# Altium schematic sheet Mordovia_MCH_CLK.SchDoc: Mordovia_MCH_CLK
size 594 x 420 mm; PageSetup: Record=PageOptions|CenterHorizontal=True|CenterVertical=True|PrintScale=0.73|XCorrection==PcbVersion0|YCorrection==PcbVersion0|PrintKind=2|BorderSize=5000000|LeftOffset=0|BottomOffset=0|Orientation=2|PaperLength=1000|PaperWidth=1000|Scale=100|PaperSource=7|PrintQuality=600|MediaType=1|DitherType=10|PaperKind=A4|PrintScaleMode=1; CheckedBy: -; CompanyName: PW ISE; DrawnBy: F. Świtakowski; Organization: ISE; Address1: WUT ISE; Address2: Nowowiejska 15/19 00-665 Warsaw; Address3: gkasprow@gmail.com; Revision: 1; SheetNumber: -; SheetTotal: -; ModifiedBy: -; CreateDate: -; CheckedDate: -; Title2: Thongue 2 adapter; DivGrp: PERG; Designer: F. Świtakowski; ModifiedDate: -
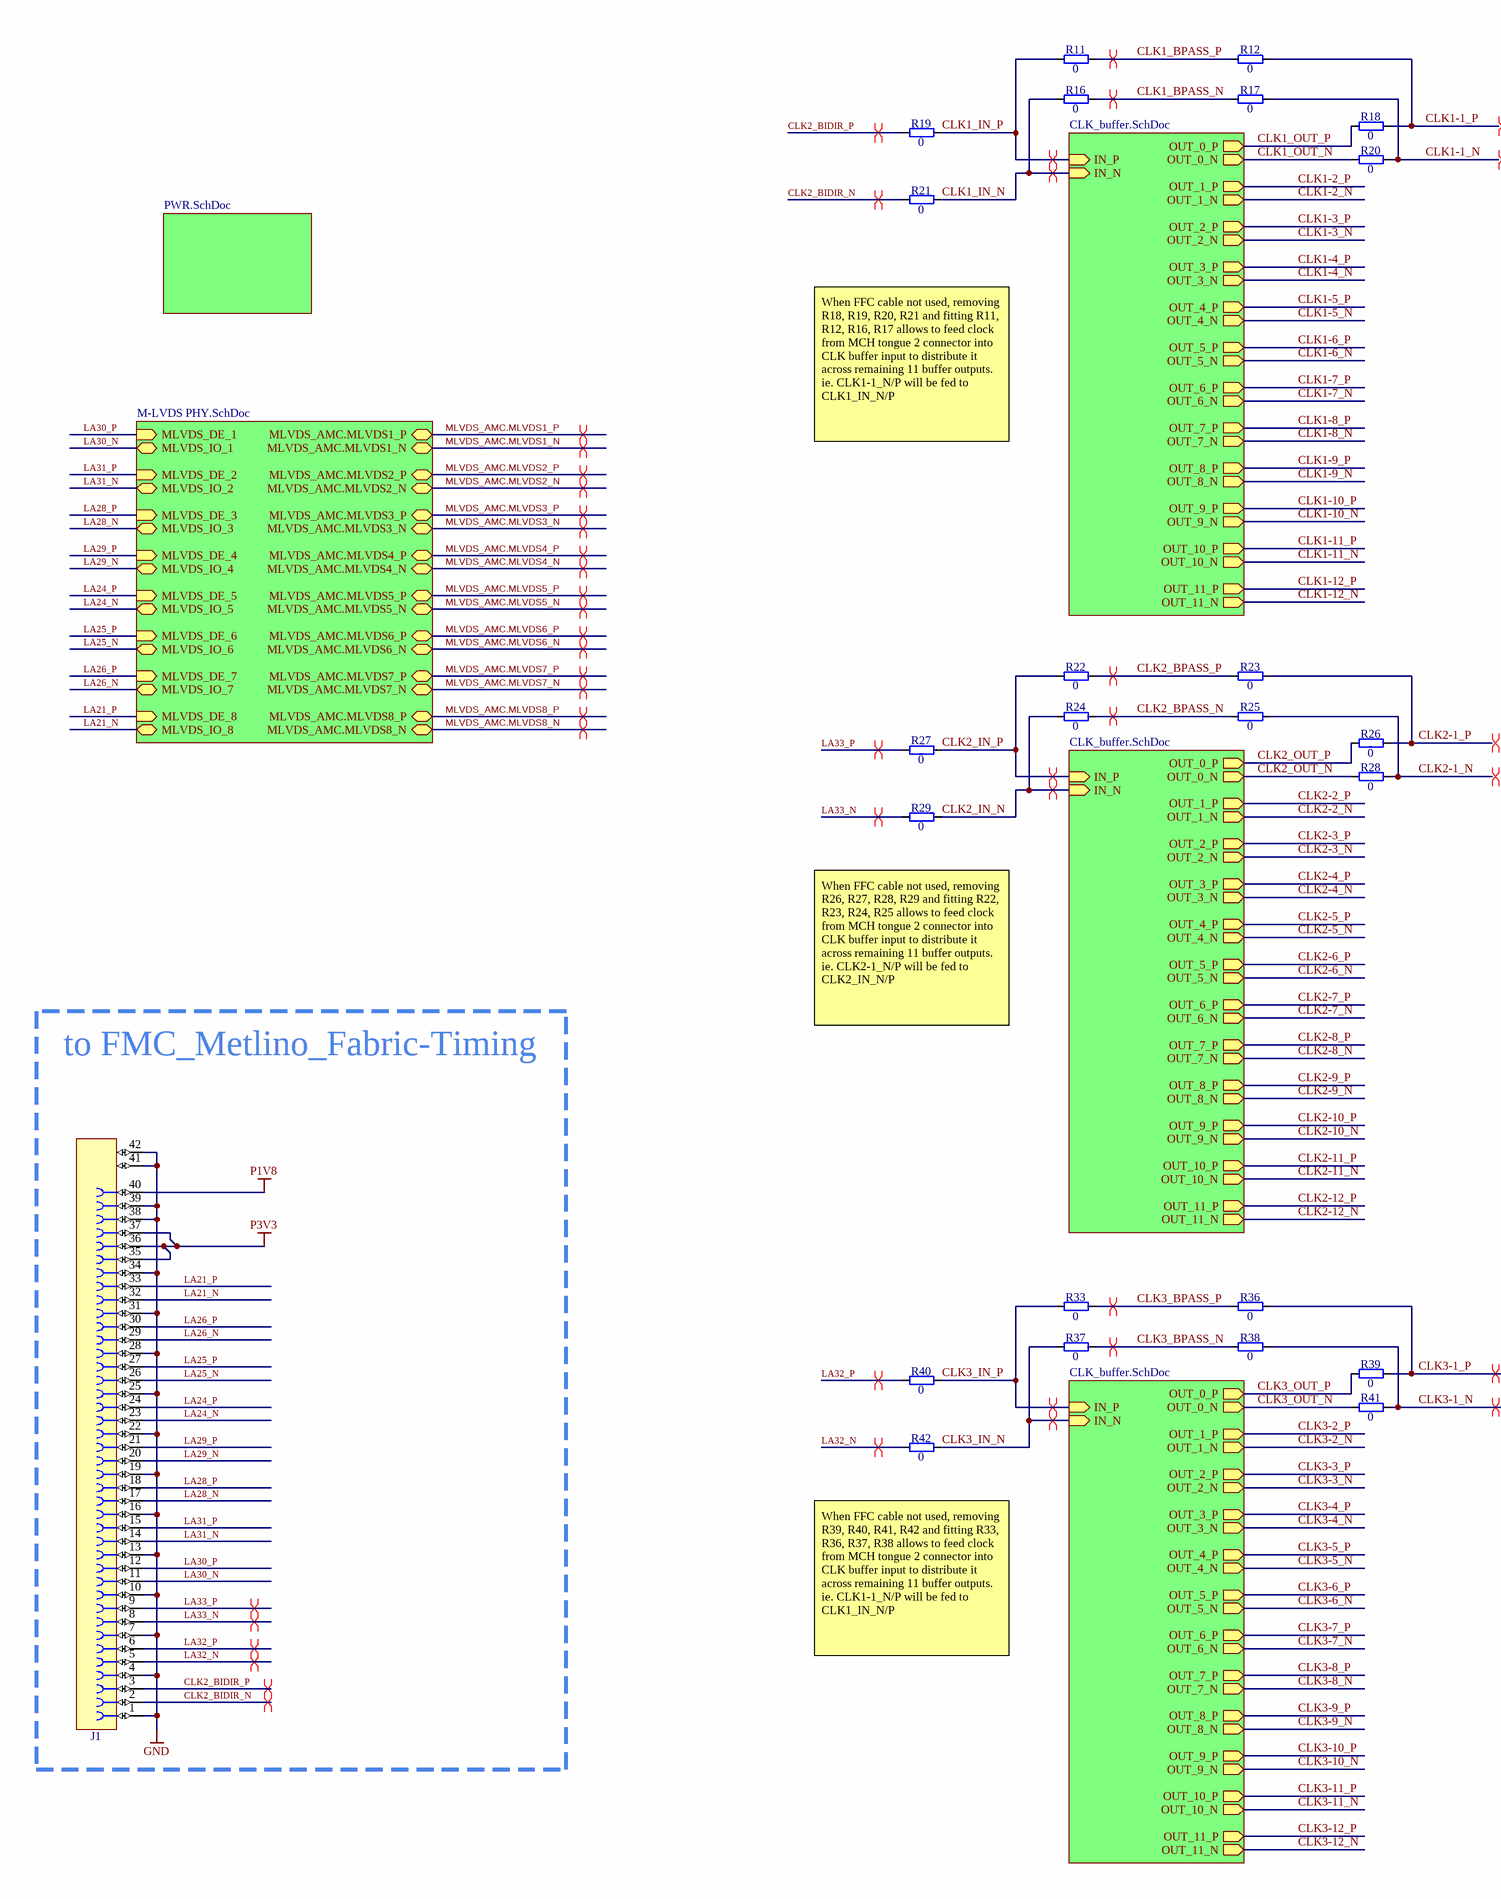
[diagram p0: Mordovia_MCH_CLK.SchDoc, left]
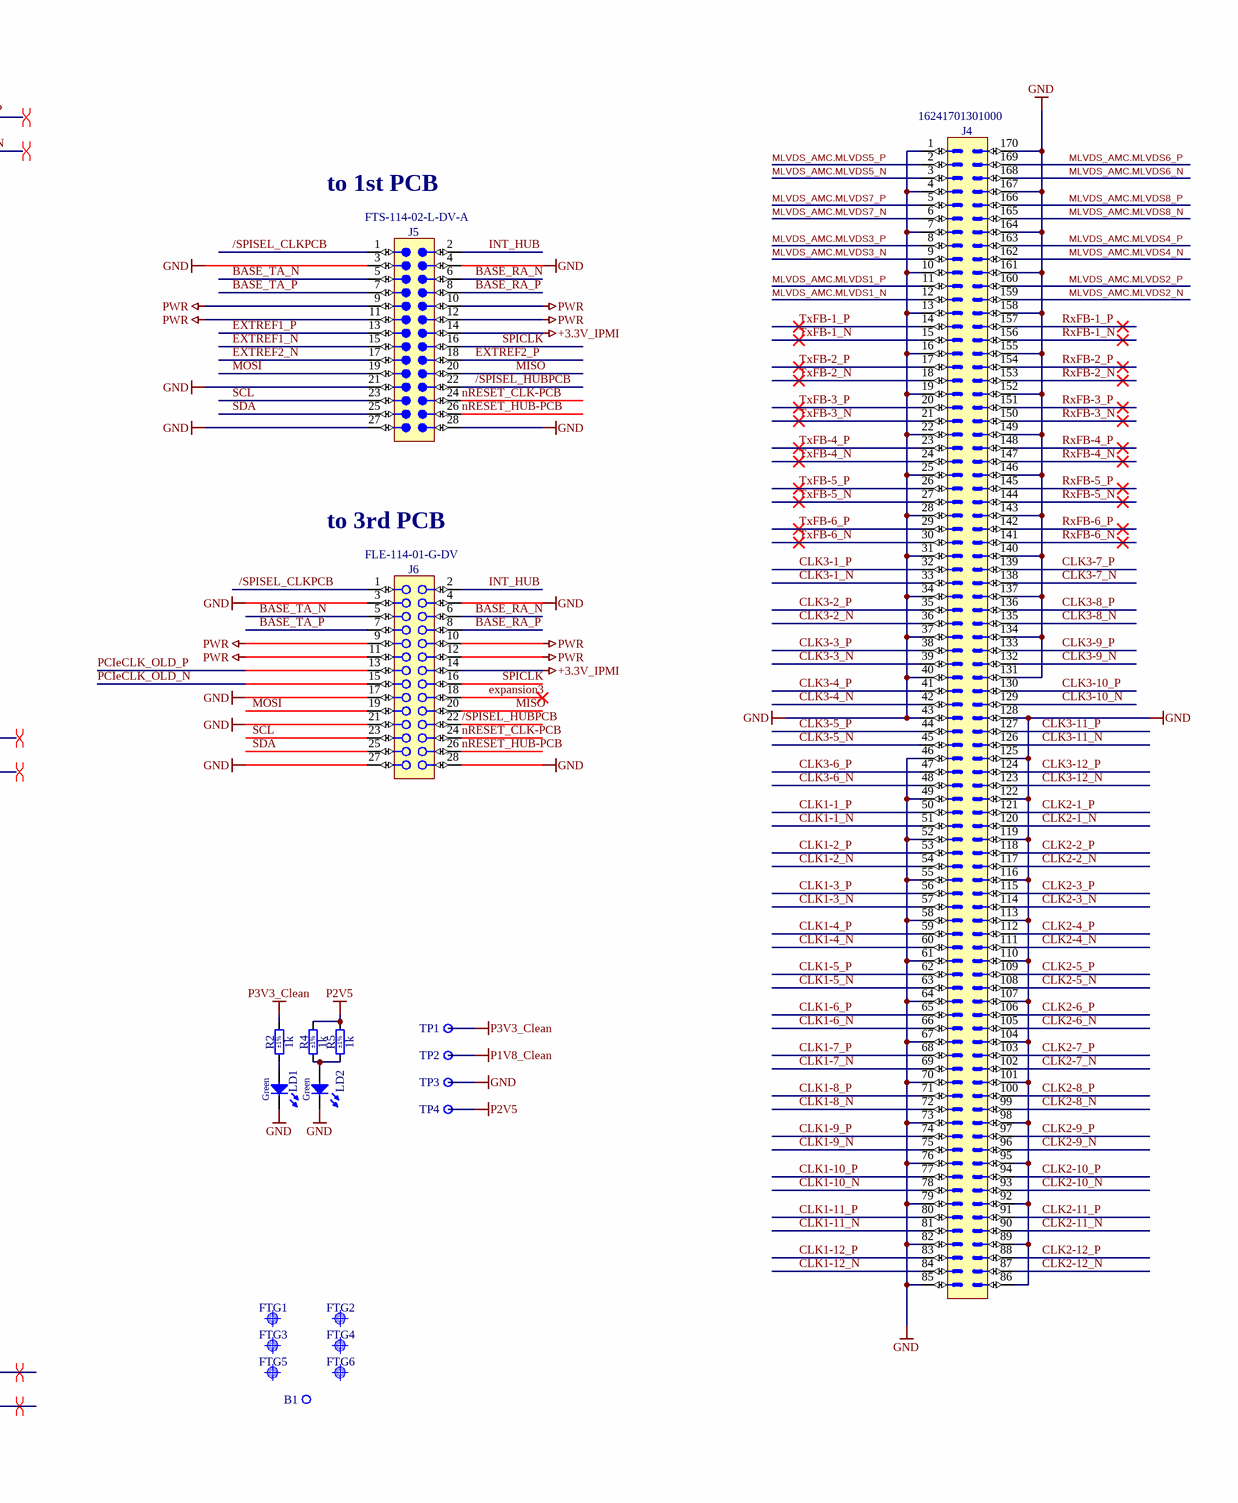
[diagram p1: Mordovia_MCH_CLK.SchDoc, right]

## Parts
B1  Non Plated Hole  [MTG520]  (value not drawn)  (no BOM)
FTG1  Use only in PCB  [FIDUCIAL_TOP_S100-200]  (value not drawn)  (no BOM)
FTG2  Use only in PCB  [FIDUCIAL_TOP_S100-200]  (value not drawn)  (no BOM)
FTG3  Use only in PCB  [FIDUCIAL_TOP_S100-200]  (value not drawn)  (no BOM)
FTG4  Use only in PCB  [FIDUCIAL_TOP_S100-200]  (value not drawn)  (no BOM)
FTG5  Use only in PCB  [FIDUCIAL_TOP_S100-200]  (value not drawn)  (no BOM)
FTG6  Use only in PCB  [FIDUCIAL_TOP_S100-200]  (value not drawn)  (no BOM)
J1  FFC/FPC  [MOLEX_505110-4091]  (value not drawn)
J4  Manufacturer Part Number: 16241701301000  [ITB_16241701301000]
J5  Manufacturer Part Number: FTS-114-02-L-DV-A  [SAMTEC_FTS-114-02-L-DV-A]  (hidden comment: Header 28)
J6  Manufacturer Part Number: FLE-114-01-G-DV  [SAMTEC_FLE-114-01-G-DV]  (hidden comment: Socket 28)
LD1  Green  [LED_OSRAM_LGL29K]
LD2  Green  [LED_OSRAM_LGL29K]
R2  1k  Tolerance: ±1%  [RESC1005X40N]
R4  1k  Tolerance: ±1%  [RESC1005X40N]
R5  1k  Tolerance: ±1%  [RESC1005X40N]
R11  0  [RESC0603X28N]
R12  0  [RESC0603X28N]
R16  0  [RESC0603X28N]
R17  0  [RESC0603X28N]
R18  0  [RESC0603X28N]
R19  0  [RESC0603X28N]
R20  0  [RESC0603X28N]
R21  0  [RESC0603X28N]
R22  0  [RESC0603X28N]
R23  0  [RESC0603X28N]
R24  0  [RESC0603X28N]
R25  0  [RESC0603X28N]
R26  0  [RESC0603X28N]
R27  0  [RESC0603X28N]
R28  0  [RESC0603X28N]
R29  0  [RESC0603X28N]
R33  0  [RESC0603X28N]
R36  0  [RESC0603X28N]
R37  0  [RESC0603X28N]
R38  0  [RESC0603X28N]
R39  0  [RESC0603X28N]
R40  0  [RESC0603X28N]
R41  0  [RESC0603X28N]
R42  0  [RESC0603X28N]
TP1  Test Point  [TPS127]  (value not drawn)  (no BOM)
TP2  Test Point  [TPS127]  (value not drawn)  (no BOM)
TP3  Test Point  [TPS127]  (value not drawn)  (no BOM)
TP4  Test Point  [TPS127]  (value not drawn)  (no BOM)

## Blocks framed on the sheet
to FMC_Metlino_Fabric-Timing: J1

## Sub-sheets
1 = CLK_buffer.SchDoc: OUT_0_P (out), OUT_0_N (out), IN_P (in), IN_N (in), OUT_1_P (out), OUT_1_N (out), OUT_2_P (out), OUT_2_N (out), OUT_3_P (out), OUT_3_N (out), OUT_4_P (out), OUT_4_N (out), OUT_5_P (out), OUT_5_N (out), OUT_6_P (out), OUT_6_N (out), OUT_7_P (out), OUT_7_N (out), OUT_8_P (out), OUT_8_N (out), OUT_9_P (out), OUT_9_N (out), OUT_10_P (out), OUT_10_N (out), OUT_11_P (out), OUT_11_N (out)
2 = CLK_buffer.SchDoc: OUT_0_P (out), OUT_0_N (out), IN_P (in), IN_N (in), OUT_1_P (out), OUT_1_N (out), OUT_2_P (out), OUT_2_N (out), OUT_3_P (out), OUT_3_N (out), OUT_4_P (out), OUT_4_N (out), OUT_5_P (out), OUT_5_N (out), OUT_6_P (out), OUT_6_N (out), OUT_7_P (out), OUT_7_N (out), OUT_8_P (out), OUT_8_N (out), OUT_9_P (out), OUT_9_N (out), OUT_10_P (out), OUT_10_N (out), OUT_11_P (out), OUT_11_N (out)
3 = CLK_buffer.SchDoc: OUT_0_P (out), OUT_0_N (out), IN_P (in), IN_N (in), OUT_1_P (out), OUT_1_N (out), OUT_2_P (out), OUT_2_N (out), OUT_3_P (out), OUT_3_N (out), OUT_4_P (out), OUT_4_N (out), OUT_5_P (out), OUT_5_N (out), OUT_6_P (out), OUT_6_N (out), OUT_7_P (out), OUT_7_N (out), OUT_8_P (out), OUT_8_N (out), OUT_9_P (out), OUT_9_N (out), OUT_10_P (out), OUT_10_N (out), OUT_11_P (out), OUT_11_N (out)
m-lvds = M-LVDS PHY.SchDoc: MLVDS_DE_1 (in), MLVDS_IO_1 (bidir), MLVDS_AMC.MLVDS1_P (bidir), MLVDS_AMC.MLVDS1_N (bidir), MLVDS_DE_2 (in), MLVDS_IO_2 (bidir), MLVDS_AMC.MLVDS2_P (bidir), MLVDS_AMC.MLVDS2_N (bidir), MLVDS_DE_3 (in), MLVDS_IO_3 (bidir), MLVDS_AMC.MLVDS3_P (bidir), MLVDS_AMC.MLVDS3_N (bidir), MLVDS_DE_4 (in), MLVDS_IO_4 (bidir), MLVDS_AMC.MLVDS4_P (bidir), MLVDS_AMC.MLVDS4_N (bidir), MLVDS_DE_5 (in), MLVDS_IO_5 (bidir), MLVDS_AMC.MLVDS5_P (bidir), MLVDS_AMC.MLVDS5_N (bidir), MLVDS_DE_6 (in), MLVDS_IO_6 (bidir), MLVDS_AMC.MLVDS6_P (bidir), MLVDS_AMC.MLVDS6_N (bidir), MLVDS_DE_7 (in), MLVDS_IO_7 (bidir), MLVDS_AMC.MLVDS7_P (bidir), MLVDS_AMC.MLVDS7_N (bidir), MLVDS_DE_8 (in), MLVDS_IO_8 (bidir), MLVDS_AMC.MLVDS8_P (bidir), MLVDS_AMC.MLVDS8_N (bidir)
PWR = PWR.SchDoc: no entries

## Nets
+3.3V_IPMI: J5.14 J6.14
GND: J1.1 J1.4 J1.7 J1.10 J1.13 J1.16 J1.19 J1.22 J1.25 J1.28 J1.31 J1.34 J1.38 J1.39 J1.41 J1.42 J4.1 J4.4 J4.7 J4.10 J4.13 J4.16 J4.19 J4.22 J4.25 J4.28 J4.31 J4.34 J4.37 J4.40 J4.43 J4.46 J4.49 J4.52 J4.55 J4.58 J4.61 J4.64 J4.67 J4.70 J4.73 J4.76 J4.79 J4.82 J4.85 J4.86 J4.89 J4.92 J4.95 J4.98 J4.101 J4.104 J4.107 J4.110 J4.113 J4.116 J4.119 J4.122 J4.125 J4.128 J4.131 J4.134 J4.137 J4.140 J4.143 J4.146 J4.149 J4.152 J4.155 J4.158 J4.161 J4.164 J4.167 J4.170 J5.3 J5.4 J5.21 J5.27 J5.28 J6.3 J6.4 J6.17 J6.21 J6.27 J6.28 LD1.1(C) LD2.1(C) TP3.1
P1V8: J1.40
P1V8_Clean: TP2.1
P2V5: R4.2 R5.2 TP4.1
P3V3: J1.35 J1.36 J1.37
P3V3_Clean: R2.2 TP1.1
PWR: J5.9 J5.10 J5.11 J5.12 J6.9 J6.10 J6.11 J6.12
/SPISEL_CLKPCB: J5.1 J6.1
/SPISEL_HUBPCB: J5.22 J6.22
BASE_RA_N: J5.6 J6.6
BASE_RA_P: J5.8 J6.8
BASE_TA_N: J5.5 J6.5
BASE_TA_P: J5.7 J6.7
CLK1-1_N: J4.51 R17.2 R20.2
CLK1-1_P: J4.50 R12.2 R18.2
CLK1-2_N: J4.54 ; sheet 1/OUT_1_N
CLK1-2_P: J4.53 ; sheet 1/OUT_1_P
CLK1-3_N: J4.57 ; sheet 1/OUT_2_N
CLK1-3_P: J4.56 ; sheet 1/OUT_2_P
CLK1-4_N: J4.60 ; sheet 1/OUT_3_N
CLK1-4_P: J4.59 ; sheet 1/OUT_3_P
CLK1-5_N: J4.63 ; sheet 1/OUT_4_N
CLK1-5_P: J4.62 ; sheet 1/OUT_4_P
CLK1-6_N: J4.66 ; sheet 1/OUT_5_N
CLK1-6_P: J4.65 ; sheet 1/OUT_5_P
CLK1-7_N: J4.69 ; sheet 1/OUT_6_N
CLK1-7_P: J4.68 ; sheet 1/OUT_6_P
CLK1-8_N: J4.72 ; sheet 1/OUT_7_N
CLK1-8_P: J4.71 ; sheet 1/OUT_7_P
CLK1-9_N: J4.75 ; sheet 1/OUT_8_N
CLK1-9_P: J4.74 ; sheet 1/OUT_8_P
CLK1-10_N: J4.78 ; sheet 1/OUT_9_N
CLK1-10_P: J4.77 ; sheet 1/OUT_9_P
CLK1-11_N: J4.81 ; sheet 1/OUT_10_N
CLK1-11_P: J4.80 ; sheet 1/OUT_10_P
CLK1-12_N: J4.84 ; sheet 1/OUT_11_N
CLK1-12_P: J4.83 ; sheet 1/OUT_11_P
CLK1_BPASS_N: R16.2 R17.1
CLK1_BPASS_P: R11.2 R12.1
CLK1_IN_N: R16.1 R21.2 ; sheet 1/IN_N
CLK1_IN_P: R11.1 R19.2 ; sheet 1/IN_P
CLK1_OUT_N: R20.1 ; sheet 1/OUT_0_N
CLK1_OUT_P: R18.1 ; sheet 1/OUT_0_P
CLK2-1_N: J4.120 R25.2 R28.2
CLK2-1_P: J4.121 R23.2 R26.2
CLK2-2_N: J4.117 ; sheet 2/OUT_1_N
CLK2-2_P: J4.118 ; sheet 2/OUT_1_P
CLK2-3_N: J4.114 ; sheet 2/OUT_2_N
CLK2-3_P: J4.115 ; sheet 2/OUT_2_P
CLK2-4_N: J4.111 ; sheet 2/OUT_3_N
CLK2-4_P: J4.112 ; sheet 2/OUT_3_P
CLK2-5_N: J4.108 ; sheet 2/OUT_4_N
CLK2-5_P: J4.109 ; sheet 2/OUT_4_P
CLK2-6_N: J4.105 ; sheet 2/OUT_5_N
CLK2-6_P: J4.106 ; sheet 2/OUT_5_P
CLK2-7_N: J4.102 ; sheet 2/OUT_6_N
CLK2-7_P: J4.103 ; sheet 2/OUT_6_P
CLK2-8_N: J4.99 ; sheet 2/OUT_7_N
CLK2-8_P: J4.100 ; sheet 2/OUT_7_P
CLK2-9_N: J4.96 ; sheet 2/OUT_8_N
CLK2-9_P: J4.97 ; sheet 2/OUT_8_P
CLK2-10_N: J4.93 ; sheet 2/OUT_9_N
CLK2-10_P: J4.94 ; sheet 2/OUT_9_P
CLK2-11_N: J4.90 ; sheet 2/OUT_10_N
CLK2-11_P: J4.91 ; sheet 2/OUT_10_P
CLK2-12_N: J4.87 ; sheet 2/OUT_11_N
CLK2-12_P: J4.88 ; sheet 2/OUT_11_P
CLK2_BIDIR_N: J1.2 R21.1
CLK2_BIDIR_P: J1.3 R19.1
CLK2_BPASS_N: R24.2 R25.1
CLK2_BPASS_P: R22.2 R23.1
CLK2_IN_N: R24.1 R29.2 ; sheet 2/IN_N
CLK2_IN_P: R22.1 R27.2 ; sheet 2/IN_P
CLK2_OUT_N: R28.1 ; sheet 2/OUT_0_N
CLK2_OUT_P: R26.1 ; sheet 2/OUT_0_P
CLK3-1_N: J4.33 R38.2 R41.2
CLK3-1_P: J4.32 R36.2 R39.2
CLK3-2_N: J4.36 ; sheet 3/OUT_1_N
CLK3-2_P: J4.35 ; sheet 3/OUT_1_P
CLK3-3_N: J4.39 ; sheet 3/OUT_2_N
CLK3-3_P: J4.38 ; sheet 3/OUT_2_P
CLK3-4_N: J4.42 ; sheet 3/OUT_3_N
CLK3-4_P: J4.41 ; sheet 3/OUT_3_P
CLK3-5_N: J4.45 ; sheet 3/OUT_4_N
CLK3-5_P: J4.44 ; sheet 3/OUT_4_P
CLK3-6_N: J4.48 ; sheet 3/OUT_5_N
CLK3-6_P: J4.47 ; sheet 3/OUT_5_P
CLK3-7_N: J4.138 ; sheet 3/OUT_6_N
CLK3-7_P: J4.139 ; sheet 3/OUT_6_P
CLK3-8_N: J4.135 ; sheet 3/OUT_7_N
CLK3-8_P: J4.136 ; sheet 3/OUT_7_P
CLK3-9_N: J4.132 ; sheet 3/OUT_8_N
CLK3-9_P: J4.133 ; sheet 3/OUT_8_P
CLK3-10_N: J4.129 ; sheet 3/OUT_9_N
CLK3-10_P: J4.130 ; sheet 3/OUT_9_P
CLK3-11_N: J4.126 ; sheet 3/OUT_10_N
CLK3-11_P: J4.127 ; sheet 3/OUT_10_P
CLK3-12_N: J4.123 ; sheet 3/OUT_11_N
CLK3-12_P: J4.124 ; sheet 3/OUT_11_P
CLK3_BPASS_N: R37.2 R38.1
CLK3_BPASS_P: R33.2 R36.1
CLK3_IN_N: R37.1 R42.2 ; sheet 3/IN_N
CLK3_IN_P: R33.1 R40.2 ; sheet 3/IN_P
CLK3_OUT_N: R41.1 ; sheet 3/OUT_0_N
CLK3_OUT_P: R39.1 ; sheet 3/OUT_0_P
expansion3: J6.18
EXTREF1_N: J5.15
EXTREF1_P: J5.13
EXTREF2_N: J5.17
EXTREF2_P: J5.18
INT_HUB: J5.2 J6.2
LA21_N: J1.32 ; sheet m-lvds/MLVDS_IO_8
LA21_P: J1.33 ; sheet m-lvds/MLVDS_DE_8
LA24_N: J1.23 ; sheet m-lvds/MLVDS_IO_5
LA24_P: J1.24 ; sheet m-lvds/MLVDS_DE_5
LA25_N: J1.26 ; sheet m-lvds/MLVDS_IO_6
LA25_P: J1.27 ; sheet m-lvds/MLVDS_DE_6
LA26_N: J1.29 ; sheet m-lvds/MLVDS_IO_7
LA26_P: J1.30 ; sheet m-lvds/MLVDS_DE_7
LA28_N: J1.17 ; sheet m-lvds/MLVDS_IO_3
LA28_P: J1.18 ; sheet m-lvds/MLVDS_DE_3
LA29_N: J1.20 ; sheet m-lvds/MLVDS_IO_4
LA29_P: J1.21 ; sheet m-lvds/MLVDS_DE_4
LA30_N: J1.11 ; sheet m-lvds/MLVDS_IO_1
LA30_P: J1.12 ; sheet m-lvds/MLVDS_DE_1
LA31_N: J1.14 ; sheet m-lvds/MLVDS_IO_2
LA31_P: J1.15 ; sheet m-lvds/MLVDS_DE_2
LA32_N: J1.5 R42.1
LA32_P: J1.6 R40.1
LA33_N: J1.8 R29.1
LA33_P: J1.9 R27.1
MISO: J5.20 J6.20
MLVDS_AMC.MLVDS1_N: J4.12 ; sheet m-lvds/MLVDS_AMC.MLVDS1_N
MLVDS_AMC.MLVDS1_P: J4.11 ; sheet m-lvds/MLVDS_AMC.MLVDS1_P
MLVDS_AMC.MLVDS2_N: J4.159 ; sheet m-lvds/MLVDS_AMC.MLVDS2_N
MLVDS_AMC.MLVDS2_P: J4.160 ; sheet m-lvds/MLVDS_AMC.MLVDS2_P
MLVDS_AMC.MLVDS3_N: J4.9 ; sheet m-lvds/MLVDS_AMC.MLVDS3_N
MLVDS_AMC.MLVDS3_P: J4.8 ; sheet m-lvds/MLVDS_AMC.MLVDS3_P
MLVDS_AMC.MLVDS4_N: J4.162 ; sheet m-lvds/MLVDS_AMC.MLVDS4_N
MLVDS_AMC.MLVDS4_P: J4.163 ; sheet m-lvds/MLVDS_AMC.MLVDS4_P
MLVDS_AMC.MLVDS5_N: J4.3 ; sheet m-lvds/MLVDS_AMC.MLVDS5_N
MLVDS_AMC.MLVDS5_P: J4.2 ; sheet m-lvds/MLVDS_AMC.MLVDS5_P
MLVDS_AMC.MLVDS6_N: J4.168 ; sheet m-lvds/MLVDS_AMC.MLVDS6_N
MLVDS_AMC.MLVDS6_P: J4.169 ; sheet m-lvds/MLVDS_AMC.MLVDS6_P
MLVDS_AMC.MLVDS7_N: J4.6 ; sheet m-lvds/MLVDS_AMC.MLVDS7_N
MLVDS_AMC.MLVDS7_P: J4.5 ; sheet m-lvds/MLVDS_AMC.MLVDS7_P
MLVDS_AMC.MLVDS8_N: J4.165 ; sheet m-lvds/MLVDS_AMC.MLVDS8_N
MLVDS_AMC.MLVDS8_P: J4.166 ; sheet m-lvds/MLVDS_AMC.MLVDS8_P
MOSI: J5.19 J6.19
nRESET_CLK-PCB: J5.24 J6.24
nRESET_HUB-PCB: J5.26 J6.26
PCIeCLK_OLD_N: J6.15
PCIeCLK_OLD_P: J6.13
RxFB-1_N: J4.156
RxFB-1_P: J4.157
RxFB-2_N: J4.153
RxFB-2_P: J4.154
RxFB-3_N: J4.150
RxFB-3_P: J4.151
RxFB-4_N: J4.147
RxFB-4_P: J4.148
RxFB-5_N: J4.144
RxFB-5_P: J4.145
RxFB-6_N: J4.141
RxFB-6_P: J4.142
SCL: J5.23 J6.23
SDA: J5.25 J6.25
SPICLK: J5.16 J6.16
TxFB-1_N: J4.15
TxFB-1_P: J4.14
TxFB-2_N: J4.18
TxFB-2_P: J4.17
TxFB-3_N: J4.21
TxFB-3_P: J4.20
TxFB-4_N: J4.24
TxFB-4_P: J4.23
TxFB-5_N: J4.27
TxFB-5_P: J4.26
TxFB-6_N: J4.30
TxFB-6_P: J4.29
NetLD1_2: LD1.2(A) R2.1
NetLD2_2: LD2.2(A) R4.1 R5.1

Not connected (* = marked no-connect by the designer): B1 1

## Layout directives
differential pair: CLK1-1_N, CLK1-1_P, CLK1_BPASS_N, CLK1_BPASS_P, CLK1_IN_N, CLK1_IN_P, CLK2-1_N, CLK2-1_P, CLK2_BIDIR_N, CLK2_BIDIR_P, CLK2_BPASS_N, CLK2_BPASS_P, CLK2_IN_N, CLK2_IN_P, CLK3-1_N, CLK3-1_P, CLK3_BPASS_N, CLK3_BPASS_P, CLK3_IN_N, CLK3_IN_P, LA32_N, LA32_P, LA33_N, LA33_P, MLVDS_AMC.MLVDS1_N, MLVDS_AMC.MLVDS1_P, MLVDS_AMC.MLVDS2_N, MLVDS_AMC.MLVDS2_P, MLVDS_AMC.MLVDS3_N, MLVDS_AMC.MLVDS3_P, MLVDS_AMC.MLVDS4_N, MLVDS_AMC.MLVDS4_P, MLVDS_AMC.MLVDS5_N, MLVDS_AMC.MLVDS5_P, MLVDS_AMC.MLVDS6_N, MLVDS_AMC.MLVDS6_P, MLVDS_AMC.MLVDS7_N, MLVDS_AMC.MLVDS7_P, MLVDS_AMC.MLVDS8_N, MLVDS_AMC.MLVDS8_P

## Notes on the sheet
- to 1st PCB
- When FFC cable not used, removing R18, R19, R20, R21 and fitting R11, R12, R16, R17 allows to feed clock from MCH tongue 2 connector into CLK buffer input to distribute it across remaining 11 buffer outputs. ie. CLK1-1_N/P will be fed to CLK1_IN_N/P
- to 3rd PCB
- When FFC cable not used, removing R26, R27, R28, R29 and fitting R22, R23, R24, R25 allows to feed clock from MCH tongue 2 connector into CLK buffer input to distribute it across remaining 11 buffer outputs. ie. CLK2-1_N/P will be fed to CLK2_IN_N/P
- When FFC cable not used, removing R39, R40, R41, R42 and fitting R33, R36, R37, R38 allows to feed clock from MCH tongue 2 connector into CLK buffer input to distribute it across remaining 11 buffer outputs. ie. CLK1-1_N/P will be fed to CLK1_IN_N/P
- Project/Equipment
- Document
- File
- Designer
- Drawn by
- Check.by
- Last Mod.
- Copyright WUT ISE 2020.
  This documentation describes Open Hardware and is licensed under the CERN OHL v.1.2. You may redistribute and modify this documentation under the terms of the CERN OHL v.1.2. (http://ohwr.org/CERNOHL). This documentation is distributed WITHOUT ANY EXPRESS OR IMPLIED WARRANTY, INCLUDING OF MERCHANTABILITY, SATISFACTORY QUALITY AND FITNESS FOR A PARTICULAR PURPOSE. Please see the CERN OHL v.1.2 for applicable conditions.
- Contact
- Print Date
- Sheet
- Size
- A2
- of
- Rev

## Library data of the parts
B1 = NON-PLATED_HOLE5.2: Single Terminal Socket; Part Description: Non Plated Through Hole: Hole Dia.=5.2mm; Mounted: No; Part Number: NON-PLATED_HOLE5.2; Component Type: Standard (No BOM); Pin Count: 1; Family: Non Plated Hole; Socket: No; SMD: No; Sense: No; Status: None; ComponentHeight: 0mm; HelpURL: Undefined; Author: CERN DEM JMW; CreateDate: 27.09.2011; LatestRevisionDate: 27.09.2011; PackageDescription: Non Plated Through Hole: Hole Dia.=5.2mm
FTG1-FTG6 = FIDUCIAL_TARGET_S100-200: Fiducial Target; Part Description: Square Fiducial Target, Top Layer, 1.0mm, Top Solder 2.0mm, Keepout =2.0mm; Mounted: No; Part Number: FIDUCIAL_TARGET_S100-200; Component Type: Standard (No BOM); Pin Count: 1; Family: Fiducial; Socket: No; SMD: Yes; Sense: No; Status: None; ComponentHeight: 0mm; HelpURL: Undefined; Author: CERN DEM JLC; CreateDate: 09.02.2010; LatestRevisionDate: 04.04.2012; PackageDescription: Square Fiducial Target, Top Layer, 1.0mm, Top Solder 2.0mm, Keepout =2.0mm
J1 = MOLEX_505110-4091: Connector 40 Female +2; Part Description: Easy-On FFC/FPC Connector 0.50mm Pitch, FD19 Series, Right-Angle, Bottom Contact, 40 Circuits; Manufacturer: MOLEX; PressFit: No; Part Number: MOLEX_505110-4091; Component Kind: Standard; Component Type: Standard; Pin Count: 42; Family: FFC/FPC; Mounted: Yes; Socket: No; SMD: Yes; Sense: No; Status: None; Manufacturer Part Number: 505110-4091; ComponentHeight: 1.92mm; HelpURL: \\cern.ch\dfs\Applications\Altium\Datasheets\MOLEX_505110-4091.pdf; Author: CERN DEM JMW; CreateDate: 22.01.2019; LatestRevisionDate: 22.01.2019
J4 = ITB_16241701301000: Connector 170 Male; Part Description: 170 Poles, MCH-Plug Connector (Basic Side); Manufacturer: ITB ADVANCED CONNECTORS; PressFit: No; Part Number: ITB_16241701301000; Component Kind: Standard; Component Type: Standard; Pin Count: 170; Family: AvancedMC; Mounted: Yes; Socket: No; SMD: No; Sense: No; Status: None; ComponentHeight: 7.63mm; HelpURL: \\cern.ch\dfs\Applications\Altium\Datasheets\ITB_16241701301000.pdf; Author: CERN DEM MR; CreateDate: 17.05.2016; LatestRevisionDate: 17.05.2016
J5 = SAMTEC_FTS-114-02-L-DV-A: Connector 28 Male; Part Description: 28 Contacts, Pitch 1.27mm - Dual Row Surface Mount Straight Strip Header; Manufacturer: SAMTEC; PressFit: No; Part Number: SAMTEC_FTS-114-02-L-DV-A; Component Kind: Standard; Component Type: Standard; Pin Count: 28; Family: Header 28; Mounted: Yes; Socket: No; Sense: No; SMD: Yes; Status: None; ComponentHeight: 3.18mm; HelpURL: \\cern.ch\dfs\Applications\Altium\Datasheets\SAMTEC_FTS-114-02-L-DV-A.pdf; Author: CERN DEM MR; CreateDate: 07.03.2016; LatestRevisionDate: 07.03.2016
J6 = SAMTEC_FLE-114-01-G-DV: Connector 28 Female; Part Description: 28 Contacts - Pitch 1.27mm - Dual Row Surface Mount Receptacle; Manufacturer: SAMTEC; PressFit: No; Part Number: SAMTEC_FLE-114-01-G-DV; Component Kind: Standard; Component Type: Standard; Pin Count: 28; Family: Socket 28; Mounted: Yes; Socket: No; Sense: No; SMD: Yes; Status: None; ComponentHeight: 4.55mm; HelpURL: \\cern.ch\dfs\Applications\Altium\Datasheets\SAMTEC_FLE-114-01-G-DV.pdf; Author: CERN DEM MR; CreateDate: 07.03.2016; LatestRevisionDate: 07.03.2016
LD1 LD2 = LED_OSRAM_LG L29K-G2J1-24-Z: LED Green 1C 2A; Part Description: Surface Mount Green LED (0603 Case); Manufacturer: OSRAM; PressFit: No; Bonding: No; Status Comment: Sourcing Difficulty; Part Number: LED_OSRAM_LG L29K-G2J1-24-Z; Component Kind: Standard; Component Type: Standard; Color: Green; PackageDescription: Green Chip LED, 2-Leads, Body 1.7x0.8mm, IPC Medium Density; Status: Not Recommended; Manufacturer Part Number: LG L29K-G2J1-24-Z; Pin Count: 2; Case: 0603; Mounted: Yes; Socket: No; SMD: Yes; Sense: No; ComponentHeight: 0.67mm; HelpURL: \\cern.ch\dfs\Applications\Altium\Datasheets\LED_OSRAM_LGL29K.pdf; Author: CERN DEM JLC; CreateDate: 24.04.2012; LatestRevisionDate: 24.04.2012
R2 R4 R5 = R0402_1K_1%_0.0625W_100PPM: Resistor - 1%; Part Description: General Purpose Thick Film Chip Resistor; Manufacturer: GENERIC; Manufacturer1 Part Number: 232270671002L; TC: ±100ppm/°C; PressFit: No; Part Number: R0402_1K_1%_0.0625W_100PPM; Component Kind: Standard; Component Type: Standard; Pin Count: 2; Value: 1k; Status: Not Recommended; Power: 0.0625W; Manufacturer Part Number: R0402_1K_1%_0.0625W_100PPM; Case: 0402; Mounted: Yes; Sense: No; Socket: No; SMD: Yes; Manufacturer1 Example: YAGEO PHYCOMP; Manufacturer1 ComponentHeight: 0.4mm; HelpURL: \\cern.ch\dfs\Applications\Altium\Datasheets\R0402_Phycomp_RC0402.pdf; Author: CERN DEM JLC; CreateDate: 03.12.2007; LatestRevisionDate: 17.10.2012
R11 R12 R16-R29 R33 R36-R42 = R0201_0R_JUMPER: Resistor; Part Description: 1A (0.05R Max DC Resistance) Zero Ohm Jumper; Manufacturer: GENERIC; Manufacturer1 Part Number: CRCW02010000Z0ED; PressFit: No; Part Number: R0201_0R_JUMPER; Component Kind: Standard; Component Type: Standard; Pin Count: 2; Value: 0; Status: Not Recommended; Manufacturer Part Number: R0201_0R_JUMPER; Case: 0201; Mounted: Yes; Sense: No; Socket: No; SMD: Yes; Manufacturer1 Example: VISHAY; Manufacturer1 ComponentHeight: 0.27mm; HelpURL: \\cern.ch\dfs\Applications\Altium\Datasheets\R0201_VISHAY_CRCW e3.pdf; Author: CERN DEM JLC; CreateDate: 11/19/2014; LatestRevisionDate: 1/8/2015
TP1-TP4 = SMD_PAD_1.27X1.27MM: Part Description: 1.27mm x 1.27mm PCB Copper Area (SMD Test Point); Mounted: No; Part Number: SMD_PAD_1.27X1.27MM; Component Type: Standard (No BOM); Pin Count: 1; Family: Test Point; Socket: No; SMD: No; Sense: No; Status: None; ComponentHeight: 0mm; HelpURL: Undefined; Author: CERN DEM JLC; CreateDate: 12.01.2008; LatestRevisionDate: 12.01.2008; PackageDescription: 1.27mm x 1.27mm PCB Copper Area (SMD Test Point)